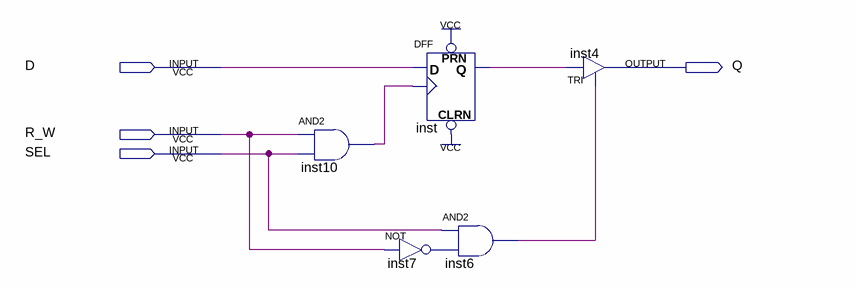
[diagram p0: schematic sheet]
// Quartus schematic celula_um_bit.bdf as structural Verilog: 5 symbols, 4 pins
module celula_um_bit (
  input  D,
  input  R_W,
  input  SEL,
  output Q
);

  wire inst6_out, inst7_out, inst10_out, inst_q;

  and inst10 (inst10_out, R_W, SEL);
  DFF inst (.CLRN(1'b1), .CLK(inst10_out), .D(D), .PRN(1'b1), .Q(inst_q));
  and inst6 (inst6_out, SEL, inst7_out);
  not inst7 (inst7_out, R_W);
  TRI inst4 (.IN(inst_q), .OE(inst6_out), .OUT(Q));
endmodule
